# EAGLE schematic Schematic (EAGLE 9.7.0)
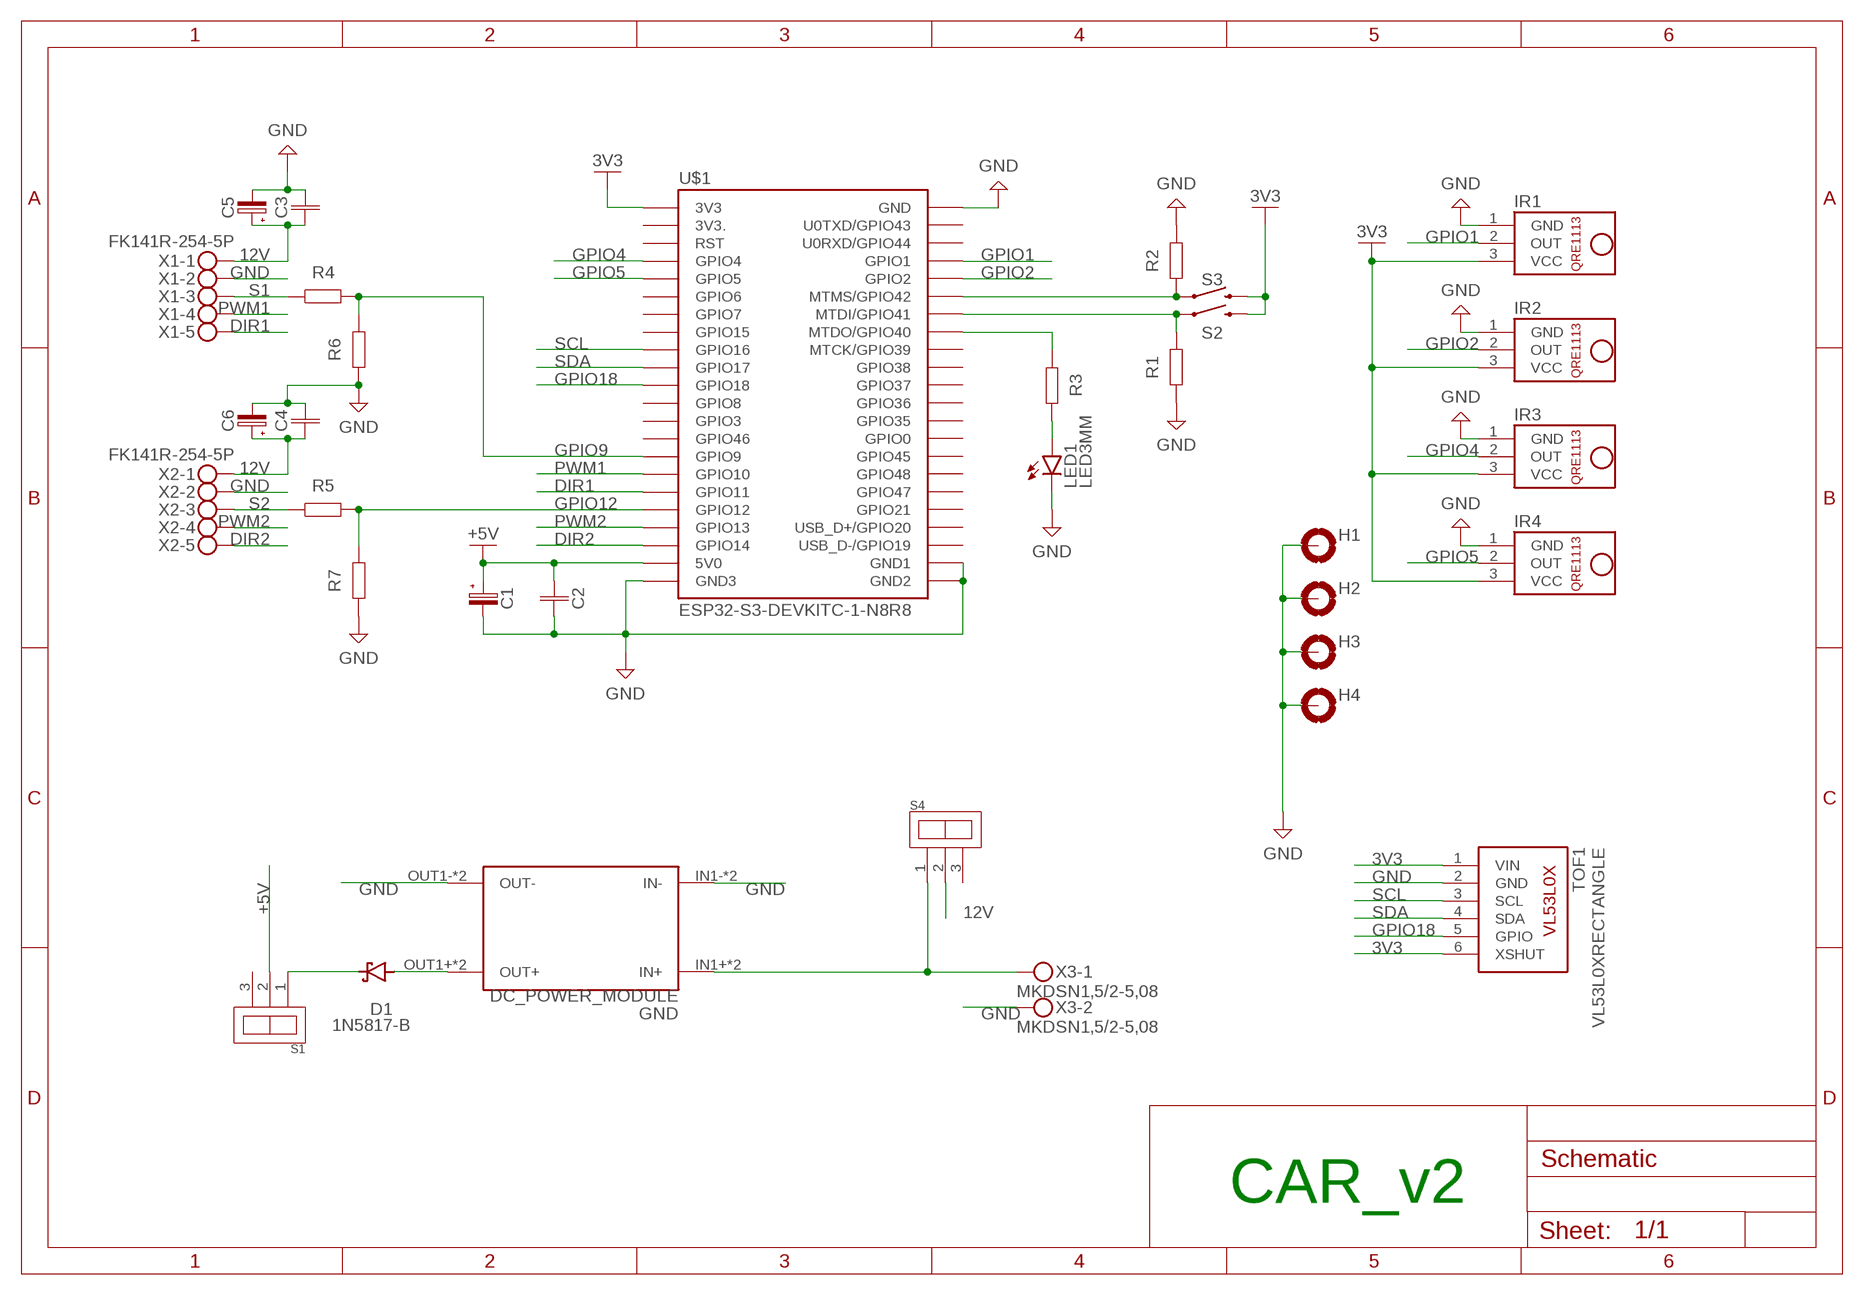
[diagram p0: schematic, sheet 1]

## Parts
C1  C-POL_RADIAL-11MM-DIA  [CAPPRD508W65D1000H1100B]
C2  CCERAMIC-2.54MM  [CAP-THRU-2.54MM]
C3  CCERAMIC-2.54MM  [CAP-THRU-2.54MM]
C4  CCERAMIC-2.54MM  [CAP-THRU-2.54MM]
C5  C-POL_RADIAL-11MM-DIA  [CAPPRD508W65D1000H1100B]
C6  C-POL_RADIAL-11MM-DIA  [CAPPRD508W65D1000H1100B]
D1  1N5817-B  [DO41-7.6]
GND  DC_POWER_MODULE  [DC_POWER_MODULE]
H1  MOUNT-PAD-ROUND3.2  [3,2-PAD]
H2  MOUNT-PAD-ROUND3.2  [3,2-PAD]
H3  MOUNT-PAD-ROUND3.2  [3,2-PAD]
H4  MOUNT-PAD-ROUND3.2  [3,2-PAD]
IR1  QRE1113  [QRE1113]
IR2  QRE1113  [QRE1113]
IR3  QRE1113  [QRE1113]
IR4  QRE1113  [QRE1113]
LED1  LED3MM  [LED3MM]
R1  R_AXIAL-11.7MM-PITCH  [RESAD1176W63L850D250B]
R2  R_AXIAL-11.7MM-PITCH  [RESAD1176W63L850D250B]
R3  R_AXIAL-11.7MM-PITCH  [RESAD1176W63L850D250B]
R4  R_AXIAL-11.7MM-PITCH  [RESAD1176W63L850D250B]
R5  R_AXIAL-11.7MM-PITCH  [RESAD1176W63L850D250B]
R6  R_AXIAL-11.7MM-PITCH  [RESAD1176W63L850D250B]
R7  R_AXIAL-11.7MM-PITCH  [RESAD1176W63L850D250B]
S1  SS12D10SS12D10_SS12D10  [SS12D10]
S2  MOMENTARY-SWITCH-SPST-PTH-12MM  [TACTILE_SWITCH_PTH_12MM]
S3  MOMENTARY-SWITCH-SPST-PTH-12MM  [TACTILE_SWITCH_PTH_12MM]
S4  SS12D10SS12D10_SS12D10  [SS12D10]
TOF1  VL53L0XRECTANGLE  [VL53L0X]
U$1  ESP32-S3-DEVKITC-1-N8R8  [ESP32-S3-DEVKITC-1-N8R8]
X1  FK141R-254-5P  [KF141R-254-5P]
X2  FK141R-254-5P  [KF141R-254-5P]
X3  MKDSN1,5/2-5,08  [MKDSN1,5/2-5,08]

## Nets
3V3: IR1.3(VCC) IR2.3(VCC) IR3.3(VCC) IR4.3(VCC) S2.3 S2.4 S3.3 S3.4 TOF1.1(VIN) TOF1.6(XSHUT) U$1.J1_1(3V3)
12V: C3.1 C4.1 C5.1(+) C6.1(+) S4.2(NULL) X1.P$1 X1.P$5 X2.P$1 X2.P$5
+5V: C1.1(+) C2.1 S1.2(NULL) U$1.J1_21(5V0)
DIR1: U$1.J1_17(GPIO11) X1.P$9 X1.P$10
DIR2: U$1.J1_20(GPIO14) X2.P$9 X2.P$10
GND: C1.2(-) C2.2 C3.2 C4.2 C5.2(-) C6.2(-) GND.IN1-(IN-) GND.IN2-(IN-) GND.OUT1-(OUT-) GND.OUT2-(OUT-) H1.B3,2(MOUNT) H2.B3,2(MOUNT) H3.B3,2(MOUNT) H4.B3,2(MOUNT) IR1.1(GND) IR2.1(GND) IR3.1(GND) IR4.1(GND) LED1.K(C) R1.1 R2.2 R6.1 R7.1 TOF1.2(GND) U$1.J1_22(GND3) U$1.J3_1(GND) U$1.J3_21(GND1) U$1.J3_22(GND2) X1.P$2 X1.P$6 X2.P$2 X2.P$6 X3.2
GPIO1: IR1.2(OUT) U$1.J3_4(GPIO1)
GPIO2: IR2.2(OUT) U$1.J3_5(GPIO2)
GPIO4: IR3.2(OUT) U$1.J1_4(GPIO4)
GPIO5: IR4.2(OUT) U$1.J1_5(GPIO5)
GPIO9: R4.2 R6.2 U$1.J1_15(GPIO9)
GPIO12: R5.2 R7.2 U$1.J1_18(GPIO12)
GPIO18: TOF1.5(GPIO) U$1.J1_11(GPIO18)
N$1: D1.A GND.OUT1+(OUT+) GND.OUT2+(OUT+)
N$2: D1.C S1.1(NULL)
N$3: R1.2 S2.1 S2.2 U$1.J3_7(MTDI/GPIO41)
N$4: R2.1 S3.1 S3.2 U$1.J3_6(MTMS/GPIO42)
N$5: R3.1 U$1.J3_8(MTDO/GPIO40)
N$6: LED1.A R3.2
N$7: GND.IN1+(IN+) GND.IN2+(IN+) S4.1(NULL) X3.1
PWM1: U$1.J1_16(GPIO10) X1.P$4 X1.P$8
PWM2: U$1.J1_19(GPIO13) X2.P$4 X2.P$8
S1: R4.1 X1.P$3 X1.P$7
S2: R5.1 X2.P$3 X2.P$7
SCL: TOF1.3(SCL) U$1.J1_9(GPIO16)
SDA: TOF1.4(SDA) U$1.J1_10(GPIO17)
Unconnected: S1.3(NULL) S4.3(NULL) U$1.J1_3(RST) U$1.J1_6(GPIO6) U$1.J1_7(GPIO7) U$1.J1_8(GPIO15) U$1.J1_12(GPIO8) U$1.J1_13(GPIO3) U$1.J1_14(GPIO46) U$1.J3_2(U0TXD/GPIO43) U$1.J3_3(U0RXD/GPIO44) U$1.J3_9(MTCK/GPIO39) U$1.J3_10(GPIO38) U$1.J3_11(GPIO37) U$1.J3_12(GPIO36) U$1.J3_13(GPIO35) U$1.J3_14(GPIO0) U$1.J3_15(GPIO45) U$1.J3_16(GPIO48) U$1.J3_17(GPIO47) U$1.J3_18(GPIO21) U$1.J3_19(USB_D+/GPIO20) U$1.J3_20(USB_D-/GPIO19)

## Notes on the sheet
- CAR_v2

## Power pins joined to a net without a drawn wire
3V3.: U$1.J1_2(3V3.)

## Library data of the parts
C1 C5 C6 = PAEN Components Library:C-POL: Capacitor Polarised - Generic
C2-C4 = PAEN Components Library:C: Capacitor - Generic
D1 = PAEN Components Library:1N581*: 1.0A SCHOTTKY BARRIER RECTIFIER Source: http://www.diodes.com/datasheets/ds23001.pdf
GND = PAEN Components Library:DC_POWER_MODULE
H1-H4 = PAEN Components Library:MOUNT-PAD-ROUND: MOUNTING PAD, round
IR1-IR4 = PAEN Components Library:QRE1113
LED1 = PAEN Components Library:LED
R1-R7 = PAEN Components Library:R: Resistor Fixed - Generic
S1 S4 = PAEN Components Library:SS12D10: Vertical Slide Switch 3 Pins 6.7x12.7x6.4mm.
S2 S3 = PAEN Components Library:MOMENTARY-SWITCH-SPST: Momentary Switch (Pushbutton) - SPST Normally-open (NO) SPST momentary switches (buttons, pushbuttons). Variants PTH-12MM - 12mm square, through-hole Momentary Pushbutton Switch - 12mm Square <https://www.sparkfun.com/products/9190> (COM-09190) PTH-6.0MM, PTH-6.0MM-KIT - 6.0mm square, through-hole Mini Pushbutton Switch <https://www.sparkfun.com/products/97> (COM-00097) KIT package intended for soldering kit's - only one side of pads' copper is exposed. PTH-RIGHT-ANGLE-KIT - Right-angle, through-hole Right Angle Tactile Button <https://www.sparkfun.com/products/10791> - Used on SparkFun BigTime Watch Kit <https://www.sparkfun.com/products/11734> SMD-12MM - 12mm square, surface-mount Tactile Button - SMD (12mm) <https://www.sparkfun.com/products/12993> (COM-12993) Used on SparkFun PicoBoard <https://www.sparkfun.com/products/11888> SMD-4.5MM - 4.5mm Square Trackball Switch Used on SparkFun Blackberry Trackballer Breakout <https://www.sparkfun.com/products/13169> SMD-4.6MMX2.8MM - 4.60mm x 2.80mm, surface mount Used on SparkFun SAMD21 Mini Breakout <https://www.sparkfun.com/products/13664> SMD-5.2MM, SMD-5.2-REDUNDANT - 5.2mm square, surface-mount Mini Pushbutton Switch - SMD <https://www.sparkfun.com/products/8720> (COM-08720) Used on Arduino Pro Mini <https://www.sparkfun.com/products/11114> REDUNDANT package connects both switch circuits together SMD-6.0X3.5MM - 6.0 x 3.5mm, surface mount Momentary Reset Switch SMD <https://www.sparkfun.com/products/8229> (COM-08229) SMD-6.2MM-TALL - 6.2mm square, surface mount Tactile Button - SMD (6mm) <https://www.sparkfun.com/products/12992> Used on SparkFun Digital Sandbox <https://www.sparkfun.com/products/12651> SMD-RIGHT-ANGLE - Right-angle, surface mount Used on SparkFun Block for Intel® Edison - Arduino <https://www.sparkfun.com/products/13036>
TOF1 = PAEN Components Library:VL53L0X
U$1 = PAEN Components Library:ESP32-S3-DEVKITC-1-N8R8: Check availability <https://pricing.snapeda.com/parts/ESP32-S3-DEVKITC-1-N8R8/Espressif%20Systems/view-part?ref=eda>
X1 X2 = PAEN Components Library:FK141R-254-5P
X3 = PAEN Components Library:MKDSN1,5/2-5,08: MKDSN 1,5/ 2-5,08 Printklemme Nennstrom: 13,5 A Nennspannung: 250 V Rastermaß: 5,08 mm Polzahl: 2 Anschlussart: Schraubanschluss Montage: Löten Anschlussrichtung Leiter/Platine: 0 ° Artikelnummer: 1729128 Source: http://eshop.phoenixcontact.com .. 1729128.pdf